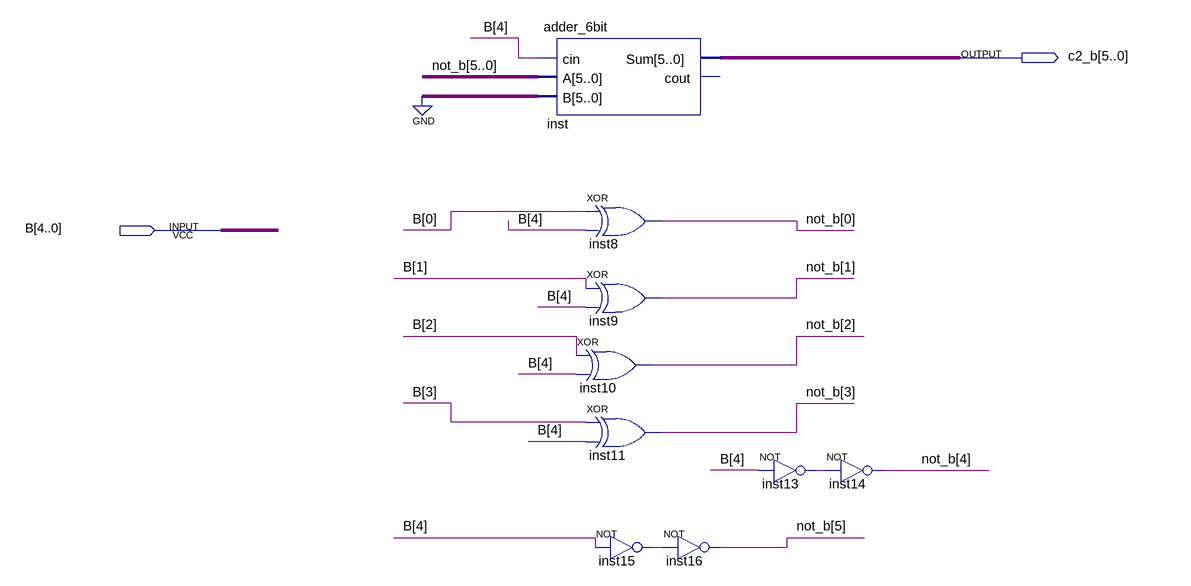
[diagram p0: schematic sheet]
// Quartus schematic c2_b.bdf as structural Verilog: 9 symbols, 2 pins
module c2_b (
  input  [4:0] B,
  output [5:0] c2_b
);

  wire inst13_out, inst15_out;
  wire [5:0] not_b;

  adder_6bit inst (.cin(B[4]), .A(not_b), .B({6{1'b0}}), .Sum(c2_b));  // open: cout
  xor inst10 (not_b[2], B[2], B[4]);
  xor inst8 (not_b[0], B[0], B[4]);
  xor inst9 (not_b[1], B[1], B[4]);
  xor inst11 (not_b[3], B[3], B[4]);
  not inst15 (inst15_out, B[4]);
  not inst16 (not_b[5], inst15_out);
  not inst13 (inst13_out, B[4]);
  not inst14 (not_b[4], inst13_out);
endmodule
